# EAGLE schematic Fablab_RFID_conroller_V0.1 (EAGLE 7.5.0)

## Sheet 1 of 2
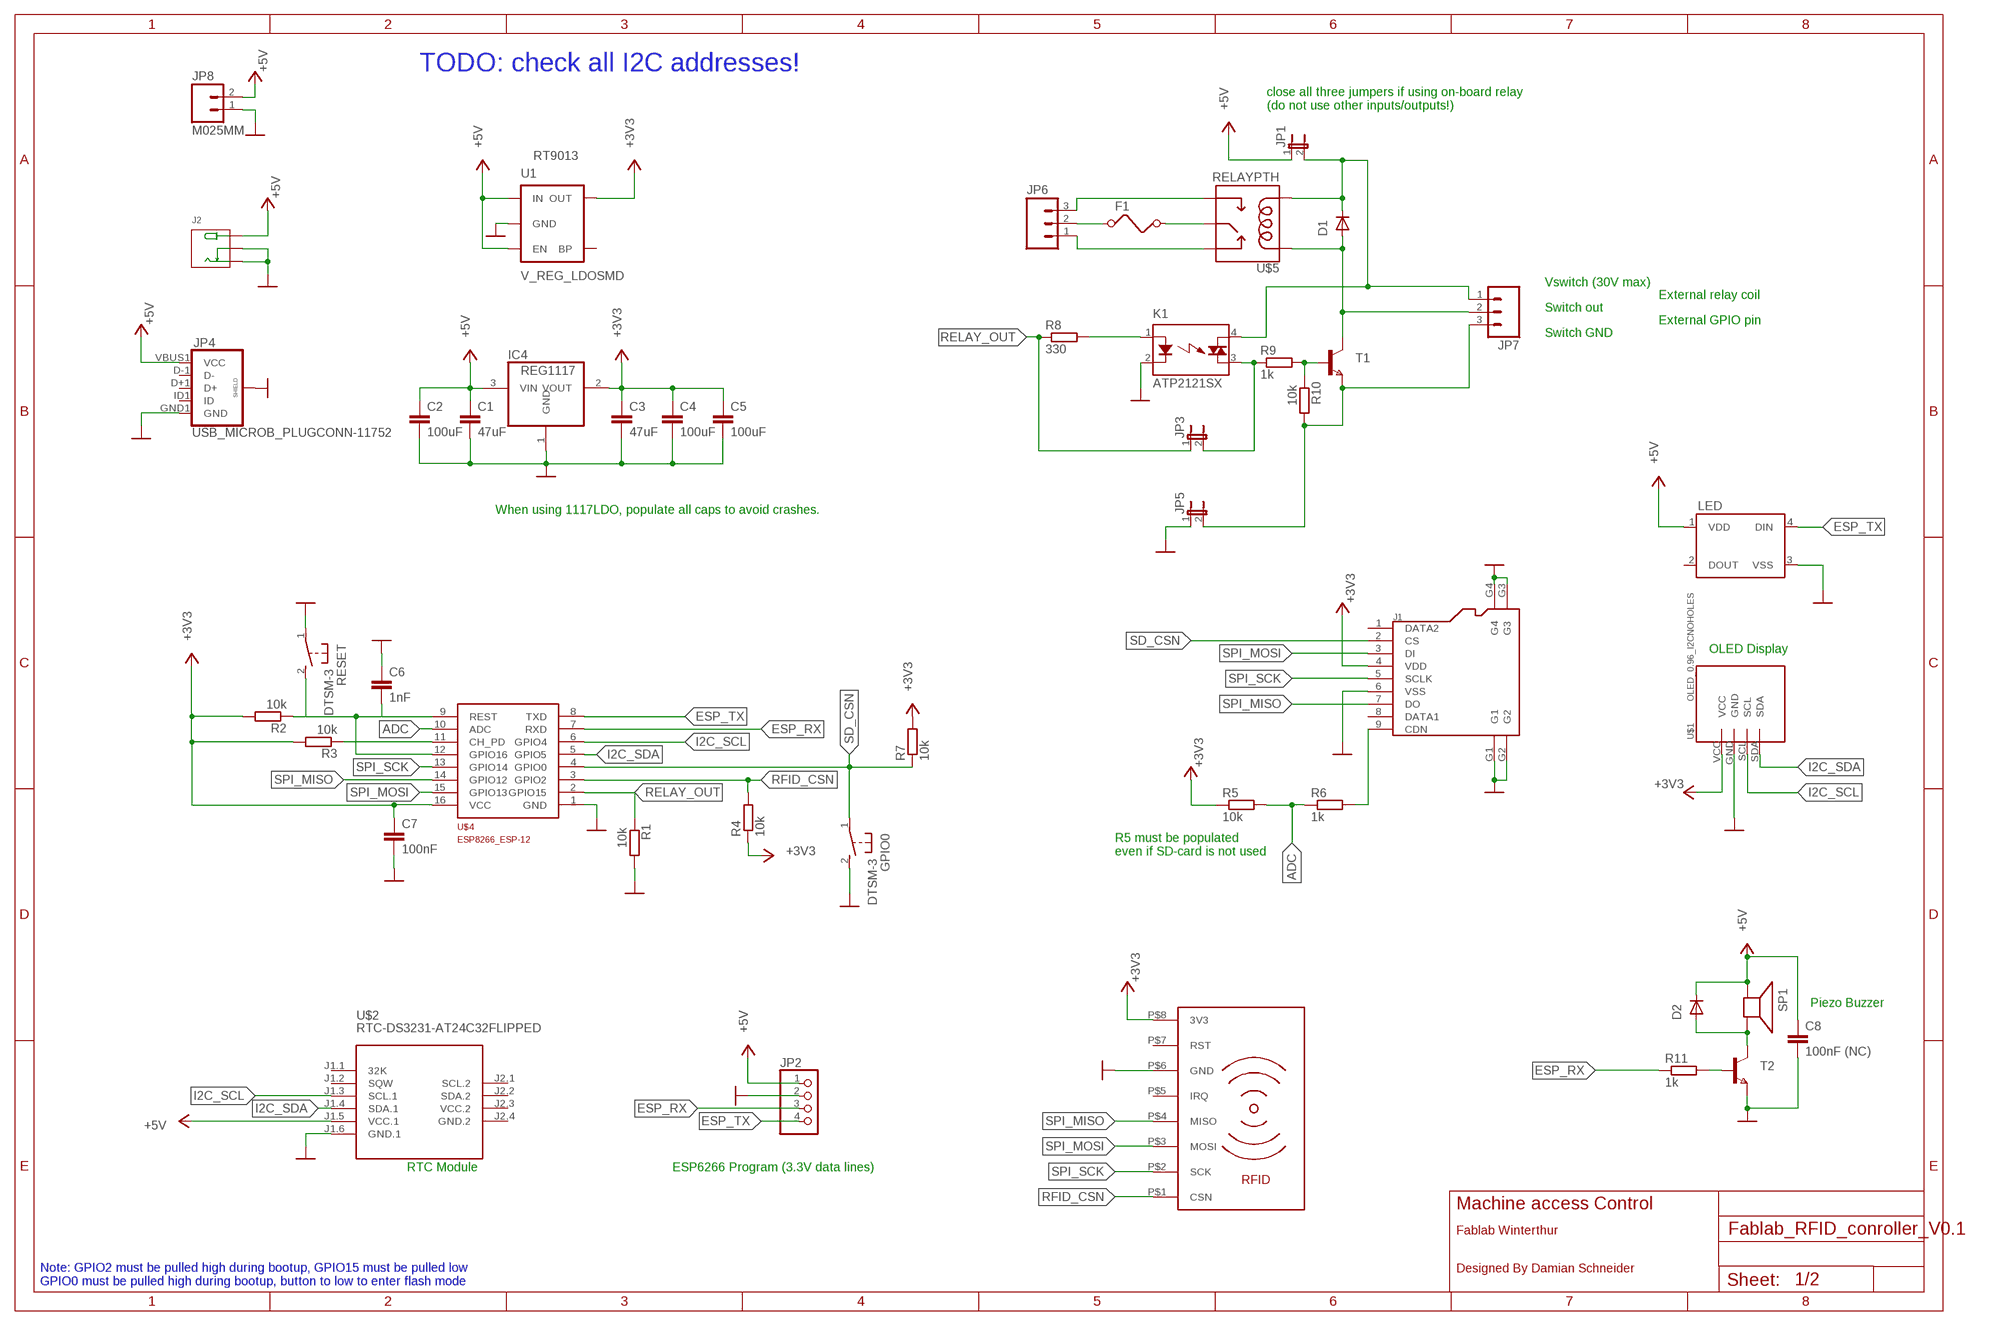
[diagram p0: schematic, sheet 1]

### Parts
C1  47uF  C-EUC0805  [C0805]
C2  100uF  C-EUC1206  [C1206]
C3  47uF  C-EUC0805  [C0805]
C4  100uF  C-EUC1206  [C1206]
C5  100uF  C-EUC1206  [C1206]
C6  1nF  C-EUC0603  [C0603]
C7  100nF  C-EUC0603  [C0603]
C8  100nF (NC)  C-EUC0603  [C0603]
D1  DIODE-MINIMELF  [MINIMELF]
D2  DIODE-MINIMELF  [MINIMELF]
F1  FUSE  [FUSE]
GPIO0  DTSM-3  [DTSM-3]
IC4  REG1117  [SOT223]
J1  MICRO-SDCARD-CONNECTOR-3300060P1  [9P-SMD-W-RING]
J2  JACK-DC-3P-3410020P1  [PW-3P-2.1]
JP1  JP1E  [JP1]
JP2  HEADER-1X476MIL  [1X04_ROUND_76]
JP3  JP1E  [JP1]
JP4  USB_MICROB_PLUGCONN-11752  [USB-B-MICRO-SMD_V03]
JP5  JP1E  [JP1]
JP6  M03-SCREW-5MM  [SCREWTERMINAL-5MM-3]
JP7  M03-SCREW-5MM  [SCREWTERMINAL-5MM-3]
JP8  M025MM  [SCREWTERMINAL-5MM-2]
K1  ATP2121SX  [SOP04]
LED  WS2812B  [WS2812B]
R1  10k  R-EU_R0603  [R0603]
R2  10k  R-EU_R0603  [R0603]
R3  10k  R-EU_R0603  [R0603]
R4  10k  R-EU_R0603  [R0603]
R5  10k  R-EU_R0603  [R0603]
R6  1k  R-EU_R0603  [R0603]
R7  10k  R-EU_R0603  [R0603]
R8  330  R-EU_R0603  [R0603]
R9  1k  R-EU_R0603  [R0603]
R10  10k  R-EU_R0603  [R0603]
R11  1k  R-EU_R0603  [R0603]
RESET  DTSM-3  [DTSM-3]
SP1  SPEAKER/AL60P  [AL60P]
T1  NPNSOT23  [SOT-23]
T2  NPNSOT23  [SOT-23]
U1  V_REG_LDOSMD  [SOT23-5]
U$1  OLED_0.96_I2CNOHOLES  [OLED_0.96_I2C_NOHOLES]
U$2  RTC-DS3231-AT24C32FLIPPED  [RTC-DS3231_FLIPPED]
U$3  RFID_MODULE_RC522  [RFID-RC522-MODULE]
U$4  ESP8266_ESP-12  [ESP8266-ESP12]
U$5  RELAYPTH  [SRD-05VDC-SL-C]

### Nets
!SDCARD_DETECT: J1.9(CDN) R6.2
+3V3: C3.1 C4.1 C5.1 C7.1 IC4.2(VOUT) J1.4(VDD) R2.2 R3.2 R4.1 R5.1 R7.2 U1.5(OUT) U$1.VCC U$3.P$8(3V3) U$4.16(VCC)
+5V: C1.1 C2.1 C8.1 D2.C IC4.3(VIN) J2.+ JP1.1 JP2.1 JP4.VBUS1(VCC) JP8.2 LED.1(VDD) SP1.1(+) U1.1(IN) U1.3(EN) U$2.J1.5(VCC.1)
ADC: R5.2 R6.1 U$4.10(ADC)
CHPD: R3.1 U$4.11(CH_PD)
ESP_RX: JP2.3 R11.1 U$4.7(RXD)
ESP_TX: JP2.4 LED.4(DIN) U$4.8(TXD)
GND: C1.2 C2.2 C3.2 C4.2 C5.2 C6.1 C7.2 C8.2 GPIO0.2 IC4.1(GND) J1.6(VSS) J1.G1 J1.G2 J1.G3 J1.G4 J2.-1(-) J2.-2(CDN) JP2.2 JP4.GND1(GND) JP4.SHIELD1(SHIELD) JP4.SHIELD2(SHIELD) JP4.SHIELD3(SHIELD) JP5.1 JP8.1 LED.3(VSS) R1.2 RESET.1 T2.2(E) U1.2(GND) U$1.GND U$2.J1.6(GND.1) U$3.P$6(GND) U$4.1(GND)
I2C_SCL: U$1.SCL U$2.J1.3(SCL.1) U$4.6(GPIO4)
I2C_SDA: U$1.SDA U$2.J1.4(SDA.1) U$4.5(GPIO5)
N$1: K1.2(K) ; supply symbol labelled GND
N$2: K1.1(A) R8.2
N$3: JP3.2 K1.3(DS2) R9.1
N$4: R9.2 R10.1 T1.3(B)
N$6: D1.A JP7.2 T1.1(C) U$5.COIL1
N$7: JP5.2 JP7.3 R10.2 T1.2(E)
N$8: D2.A SP1.2(-) T2.1(C)
N$9: JP1.2 JP7.1 K1.4(DS1)
N$10: D1.C U$5.COIL0
N$11: R11.2 T2.3(B)
N$12: F1.1 JP6.2
N$13: JP6.3 U$5.SW_NO(SWOPEN)
N$14: F1.2 U$5.SWCOMMON
N$15: JP6.1 U$5.SW_NC(SWCLOSE)
RELAY_OUT: JP3.1 R1.1 R8.1 U$4.2(GPIO15)
RESET: C6.2 R2.1 RESET.2 U$4.9(REST) U$4.12(GPIO16)
RFID_CSN: R4.2 U$3.P$1(CSN) U$4.3(GPIO2)
SD_CSN: GPIO0.1 J1.2(CS) R7.1 U$4.4(GPIO0)
SPI_MISO: J1.7(DO) U$3.P$4(MISO) U$4.14(GPIO12)
SPI_MOSI: J1.3(DI) U$3.P$3(MOSI) U$4.15(GPIO13)
SPI_SCK: J1.5(SCLK) U$3.P$2(SCK) U$4.13(GPIO14)
Unconnected: J1.1(DATA2) J1.8(DATA1) JP4.D+1(D+) JP4.D-1(D-) JP4.ID1(ID) LED.2(DOUT) U1.4(BP) U$2.J1.1(32K) U$2.J1.2(SQW) U$2.J2.1(SCL.2) U$2.J2.2(SDA.2) U$3.P$5(IRQ) U$3.P$7(RST)

### Notes on the sheet
- TODO: check all I2C addresses!
- close all three jumpers if using on-board relay
  (do not use other inputs/outputs!)
- RT9013
- Vswitch (30V max)
- External relay coil
- Switch out
- External GPIO pin
- Switch GND
- When using 1117LDO, populate all caps to avoid crashes.
- OLED Display
- R5 must be populated
  even if SD-card is not used
- Piezo Buzzer
- RTC Module | ESP6266 Program (3.3V data lines)
- Machine access Control
- Fablab Winterthur
- Designed By Damian Schneider
- Note: GPIO2 must be pulled high during bootup, GPIO15 must be pulled low
  GPIO0 must be pulled high during bootup, button to low to enter flash mode

## Sheet 2 of 2

## Power pins joined to a net without a drawn wire
GND.2: U$2.J2.4(GND.2)
VCC.2: U$2.J2.3(VCC.2)

## Library data of the parts
C1-C8 = resistor:C-EU: CAPACITOR, European symbol
D1 D2 = diode:DIODE-: DIODE
F1 = special:FUSE: FUSE 5 x 20 mm
GPIO0 RESET = switch-mini-chinese-tact:DTSM-3
IC4 = burr-brown:REG1117: 800mA and 1A Low Dropout (LDO) Positive Regulator 1.8V, 2.5V, 2.85V, 3.3V, 5V, and Adj; MPN: REG1117; OC_FARNELL: 1097566; OC_NEWARK: 14P6981
J1 = OPL Eagle Library:MICRO-SDCARD-CONNECTOR: Micro SD Card
J2 = OPL Eagle Library:JACK-DC-3P
JP1 JP3 JP5 = jumper:JP1E: JUMPER
JP2 = microbuilder:HEADER-1X4: PIN HEADER
JP4 = Micro-USB-noname:USB_MICROB_PLUG: USB Micro-B connectors Some male, some female. Watch your step!; PROD_ID: CONN-11752
JP6 JP7 = SparkFun-Connectors:M03: Header 3 Standard 3-pin 0.1" header. Use with straight break away headers (SKU : PRT-00116), right angle break away headers (PRT-00553), swiss pins (PRT-00743), machine pins (PRT-00117), and female headers (PRT-00115). Molex polarized connector foot print use with SKU : PRT-08232 with associated crimp pins and housings.; STOREFRONT_ID: PRT-08433
JP8 = smd_pinheader:M02: Standard 2-pin 0.1" header. Use with - straight break away headers ( PRT-00116) - right angle break away headers (PRT-00553) - swiss pins (PRT-00743) - machine pins (PRT-00117) - female headers (PRT-00115) Molex polarized connector foot print use with: PRT-08233 with associated crimp pins and housings. 2.54_SCREWTERM for use with PRT-10571. 3.5mm Screw Terminal footprints for PRT-08084 5mm Screw Terminal footprints for use with PRT-08432; STOREFRONT_ID: PRT-08432
K1 = relay:ATP2121S*: Phototriac Coupler none Zero-Cross NAiS Source: http://www.mew-europe.com/.. en_ds_61690_0000.pdf; OC_FARNELL: unknown; OC_NEWARK: unknown
LED = SparkFun-LED:WS2812B: WS2812B - Intelligent control LED integrated light source Technical Specifications: Power Supply Voltage (VDD): 3.5 to 5.3 V Input Voltage (VI): -0.5 to VDD+0.5 V Operating Junction Temperature (Topt): -25°C to +80°C Storage Temperature Range (Tstg): -55°C to +150°C
R1-R11 = resistor:R-EU_: RESISTOR, European symbol
SP1 = adafruit:SPEAKER: SPEAKER Source: Buerklin Added PS12 (for part # PS1240 piezo) http://www.ladyada.net/library/pcb/eaglelibrary.html
T1 T2 = zetex:NPNSOT23: NPN TRANSISTOR; MPN: DSS20201L-7; OC_FARNELL: 1710688; OC_NEWARK: 25R4555
U1 = SparkFun-PowerIC:V_REG_LDO: Voltage Regulator LDO Standard 150mA LDO voltage regulator in SOT-23 layout. Micrel part MIC5205. BP (by-pass) pin is used to lower output noise with 470pF cap.
U$1 = tft_1.8_1.44_oled_0.96:OLED_0.96_I2C
U$2 = diy-modules:RTC-DS3231-AT24C32: RTC Module with Battery and EEPROM based on DS3231 and AT24C32 chips Tutorial can be found here: https://edwardmallon.wordpress.com/2014/05/21/using-a-cheap-3-ds3231-rtc-at24c32-eeprom-from-ebay/ Click here to find device on ebay.com <http://www.ebay.com/sch/DS3231+AT24C32+module>
U$3 = RFID-RC522_module:RFID_MODULE_RC522
U$4 = ESP8266-ESP12:ESP8266_ESP-12
U$5 = SRD-05VDC-SL-C:RELAY: SPDT relay (COM-00101)